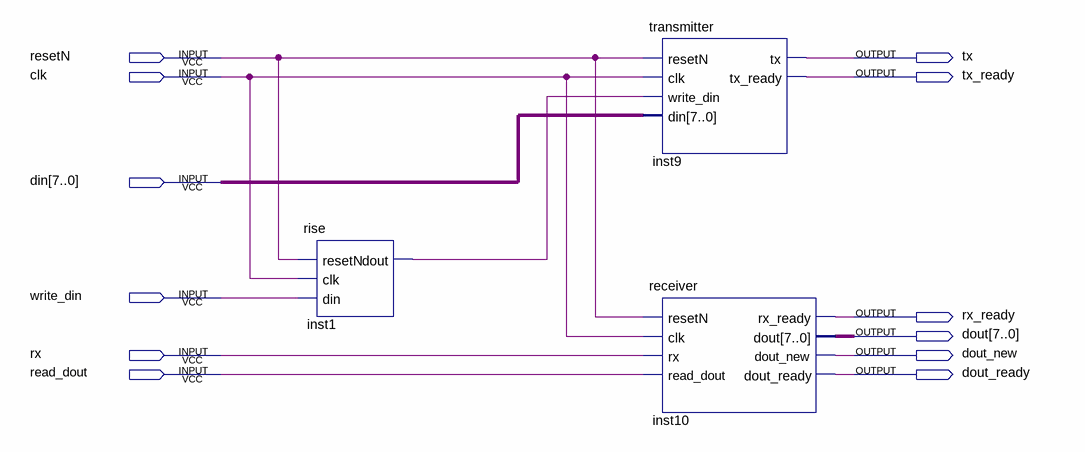
[diagram p0: schematic sheet]
// Quartus schematic uart_complete.bdf as structural Verilog: 3 symbols, 12 pins
module uart_complete (
  input  resetN,
  input  clk,
  input  [7:0] din,
  input  write_din,
  input  rx,
  input  read_dout,
  output tx,
  output tx_ready,
  output rx_ready,
  output [7:0] dout,
  output dout_new,
  output dout_ready
);

  wire inst1_dout;

  rise inst1 (.resetN(resetN), .clk(clk), .din(write_din), .dout(inst1_dout));
  transmitter inst9 (.resetN(resetN), .clk(clk), .write_din(inst1_dout), .din(din), .tx(tx), .tx_ready(tx_ready));
  receiver inst10 (
    .resetN(resetN), .clk(clk), .rx(rx), .read_dout(read_dout), .rx_ready(rx_ready), .dout(dout),
    .dout_new(dout_new), .dout_ready(dout_ready));
endmodule
